# Altium schematic sheet TPS54627DDAR.SchDoc
size A4
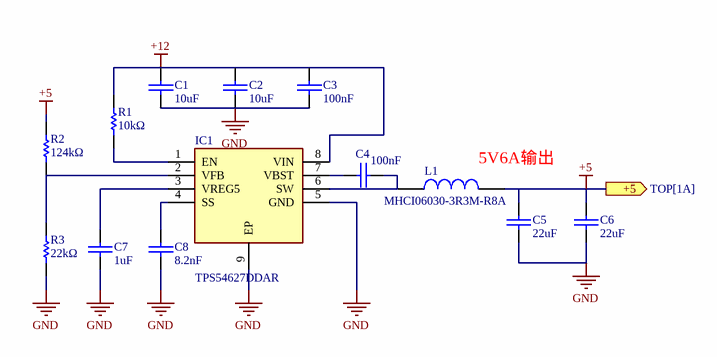
[diagram p0: TPS54627DDAR.SchDoc]

## Parts
C1  10uF  [C_1206]
C2  10uF  [C_1206]
C3  100nF  [C_0603]
C4  100nF  [C_0603]
C5  22uF  [C_0805]
C6  22uF  [C_0805]
C7  1uF  [C_0603]
C8  8.2nF  [C_0402]
IC1  TPS54627DDAR  [SOIC-8-PowerPAD]
L1  MHCI06030-3R3M-R8A  [Ind-SMD_7.3x6.6]
R1  10kΩ  [R_0402]
R2  124kΩ  [R_0402]
R3  22kΩ  [R_0402]

## Ports
+5 (out, see TOP[1A])

## Nets
+5: C5.2 C6.2 L1.2 R2.1 ; port +5
+12: C1.2 C2.2 C3.2 IC1.8(VIN) R1.2
GND: C1.1 C2.1 C3.1 C5.1 C6.1 C7.2 C8.1 IC1.5(GND) IC1.9(EP) R3.1
NetC4_1: C4.1 IC1.6(SW) L1.1
NetC4_2: C4.2 IC1.7(VBST)
NetC7_1: C7.1 IC1.3(VREG5)
NetC8_2: C8.2 IC1.4(SS)
NetIC1_1: IC1.1(EN) R1.1
NetIC1_2: IC1.2(VFB) R2.2 R3.2

## Notes on the sheet
- (near L1) 5V6A输出

## Library data of the parts
C1-C8 = Cap_Chip: 贴片电容; Manufacturer_Name: *; Manufacturer_Part_Number: *
IC1 = TPS54627DDAR: DC-DC 降压芯片; Manufacturer_Name: Texas Instruments; Manufacturer_Part_Number: TPS54627DDAR; LCSC: C398919,C353861
L1 = Ind_Molded: 一体成型功率电感; Manufacturer_Name: *; Manufacturer_Part_Number: *
R1-R3 = Res_Chip: 贴片电阻
  R1: 商品编号: *; 厂家型号: *
  R2 R3: Manufacturer_Name: *; Manufacturer_Part_Number: *